# Altium schematic sheet Boost-Shield.SchDoc
size A; SheetNumber: 1; SheetTotal: 1
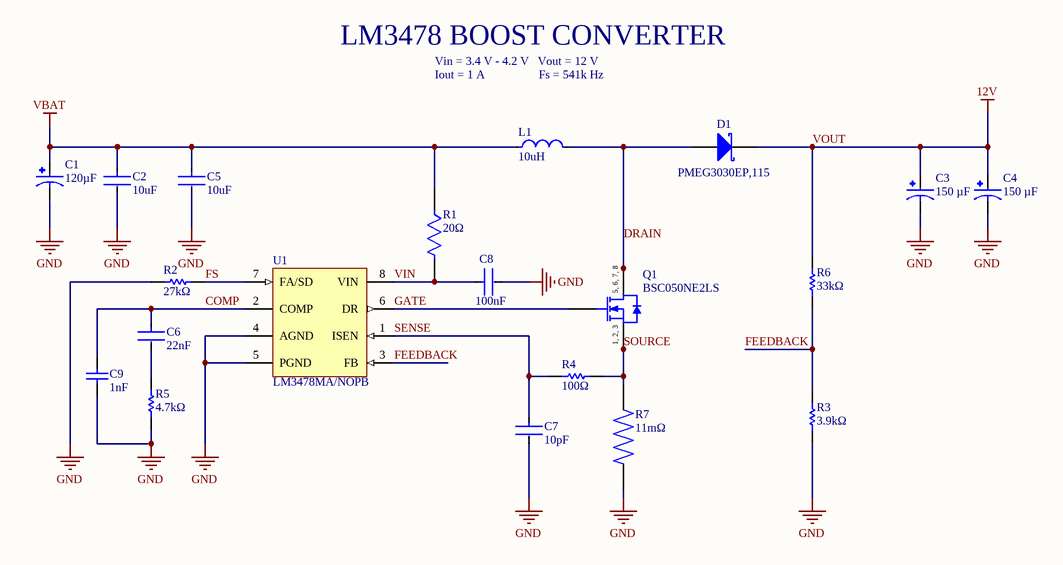
[diagram p0: Boost-Shield.SchDoc]

## Parts
C1  120µF  [CAP_EEFCX0J121R]
C2  10uF  [FP-C0805C-DG-MFG]
C3  150 µF  [CAP_16TDC150MYF]
C4  150 µF  [CAP_16TDC150MYF]
C5  10uF  [FP-C0805C-DG-MFG]
C6  22nF  [FP-CGA4J-MFG]
C7  10pF  [FP-C0805C-DN-MFG]
C8  100nF  [FP-CC0805-0_85-MFG]
C9  1nF  [CAPC2013X140X50NL20T25]
D1  PMEG3030EP,115  [NXP-SOD128_V]
L1  10uH  [FP-IHLP-3232DZ-FP_2_413x5-MFG]
Q1  BSC050NE2LS  [INF-PG-TDSON-8-1_V]
R1  20Ω  [FP-CRCW0805-e3-IPC_C]
R2  27kΩ  [RESC2013X50X30ML20T20]
R3  3.9kΩ  [RESC2013X50X30LL20T20]
R4  100Ω  [RESC2013X50X30ML20T20]
R5  4.7kΩ  [RESC2013X70X40NL20T20]
R6  33kΩ  [RESC2013X50X30LL20T20]
R7  11mΩ  [RESC3115X65N]
U1  LM3478MA/NOPB  [D0008A_L]

## Nets
GND: C1.2 C2.2 C3.2 C4.2 C5.2 C7.2 C8.2 C9.1 R2.1 R3.1 R5.1 R7.1 U1.4(AGND) U1.5(PGND)
VBAT: C1.1 C2.1 C5.1 L1.1 R1.1
VOUT: C3.1 C4.1 D1.2(K) R6.2  [also labelled 12V]
COMP: C6.1 C9.2 U1.2(COMP)
DRAIN: D1.1(A) L1.2 Q1.5(DRAIN) Q1.6(DRAIN) Q1.7(DRAIN) Q1.8(DRAIN)
FEEDBACK: R3.2 R6.1 U1.3(FB)
FS: R2.2 U1.7(FA/SD)
GATE: Q1.4(GATE) U1.6(DR)
SENSE: C7.1 R4.1 U1.1(ISEN)
SOURCE: Q1.1(SOURCE) Q1.2(SOURCE) Q1.3(SOURCE) R4.2 R7.2
VIN: C8.1 R1.2 U1.8(VIN)
NetC6_2: C6.2 R5.2

## Notes on the sheet
- LM3478 BOOST CONVERTER
- Vin = 3.4 V - 4.2 V   Vout = 12 V
  Iout = 1 A                  Fs = 541k Hz
- (in symbol CMP-1090-00044-1) 5, 6, 7, 8; 1, 2, 3

## Library data of the parts
C1 = EEFCX0J121R: 120µF 6.3V Aluminum - Polymer Capacitors 2917 (7343 Metric) 15mOhm 2000 Hrs @ 105°C  EEFCX0J121R
C2 C5 = CMP-2007-03243-2: CAP CER 10UF 10V X5R 0805; Manufacturer Part Number: C0805C106K8PACTU; Manufacturer: Kemet; 3DS Part Number: 220-00001; Tolerance: 10%; Temperature Coefficient: 15%; Material: Ceramic; Device Class L2: Capacitors; Device Class L1: Passive Components; ComponentLink2URL: https://content.kemet.com/datasheets/KEM_C1006_X5R_SMD.pdf; Height: 1.4mm; Lead Free: Yes; Digikey Description: CAP CER 10UF 10V X5R 0805; Octopart: https://octopart.com/c0805c106k8pactu-kemet-98697; Capacitance: 10uF; Value: 10uF; Temperature Range Low: -55°C; Temperature: -55°C to +85°C; Automotive: No; Mouser Description: CAP CER 10UF 10V X5R 0805; Ipc Land Pattern Name: CAPC200125X125; Temperature Range High: +85°C; Voltage: 10V; RoHS: TRUE; Device Class L3: Ceramic Capacitors; ComponentLink2Description: Datasheet; Voltage Rating: 10V; Package: C0805C-DG; Temperature Characteristic: X5R; Category: Cap
C3 C4 = 16TDC150MYF: 150 µF Molded Tantalum Polymer Capacitor 16 V 2917 (7343 Metric) 50mOhm @ 100kHz
C6 = CMP-08246-000753-1: Cap Ceramic 22nF 50V C0G 5% Pad SMD 0805 +125°C Automotive T/R CGJ4J2C0G1H223J125AA; Capacitance: 22nF; Case/Package: 0805; Lead Free: Lead Free; Ratings: AEC-Q200; Case Code (Imperial): 0805; Height: 1.25mm; Length: 2mm; Weight: 0.000194oz; Tolerance: 5%; Dielectric: C0G; Voltage Rating: 50V; Max Operating Temperature: 125°C; Mount: Surface Mount; Case Code (Metric): 2012; REACH SVHC: No SVHC; Depth: 1.25mm; Width: 0.049inch; Package Quantity: 1; Voltage Rating (DC): 50V; Termination: SMD/SMT; Min Operating Temperature: -55°C; Thickness: 0.057inch; Packaging: Tape and Reel; Composition: Ceramic
C7 = CMP-1036-00838-4: CAP CER 10PF 16V 20% NP0 0805; Manufacturer Part Number: C0805C100M4GACTU; Manufacturer: KEMET; Material: Ceramic; Tolerance: 0.2; Temperature Characteristic: C0G; Temperature Coefficient: 30ppm/°C; Height: 0.88mm; Mouser Description: Multilayer Ceramic Capacitors MLCC - SMD/SMT 16volts 10pF C0G 20%; Device Class L2: Capacitors; Temperature Range Low: -55°C; ComponentLink2URL: https://content.kemet.com/datasheets/KEM_C1003_C0G_SMD.pdf; Category: Cap; Octopart: https://octopart.com/c0805c100m4gactu-kemet-16430157; Device Class L1: Passive Components; Capacitance: 10 pF; Temperature: -55°C to +125°C; RoHS: TRUE; Package: C0805C-DN; Device Class L3: Ceramic Capacitors; Automotive: No; Value: 10 pF; Voltage Rating: 16 V; Digikey Description: CAP CER 10PF 16V 20% NP0 0805; Temperature Range High: +125°C; Ipc Land Pattern Name: CAPC200125X78; Lead Free: Yes; ComponentLink2Description: Datasheet
C8 = CMP-1036-04402-6: CAP CER 0.1UF 16V X7R 0805; Manufacturer Part Number: CC0805KRX7R7BB104; Manufacturer: Yageo; Material: Ceramic; Tolerance: 0.1; Temperature: -30°C to +85°C; Lead Free: Yes; Footprint Url: http://www.yageo.com/exep/pages/download/literatures/UPY-C_GEN_24.pdf; Voltage Rating: 16 V; Package: CC0805-0.85; RoHS: TRUE; Digikey Description: CAP CER 0.1UF 16V X7R 0805; Category: Cap; Octopart: https://octopart.com/cc0805krx7r7bb104-yageo-39467769; Capacitance: 100 nF; Device Class L3: Ceramic Capacitors; ComponentLink2URL: http://www.yageo.com/documents/recent/UPY-GPHC_Y5V_6.3V-to-50V_8.pdf; Value: 100 nF; Temperature Range Low: -30°C; Mouser Description: Multilayer Ceramic Capacitors MLCC - SMD/SMT 100nF 16V X7R 10%; Automotive: No; Device Class L2: Capacitors; Height: 0.95mm; ComponentLink2Description: Datasheet; Temperature Characteristic: X7R; Ipc Land Pattern Name: CAPC200125X85; Device Class L1: Passive Components; Temperature Range High: +85°C
C9 = CMP-2007-04527-1: 08051A102JAT2A; Manufacturer: AVX Interconnect / Elco; Part Number: 08051A102JAT2A
D1 = CMP-2000-06906-1: Schottky Barrier Rectifier, 3 A, 30 V, -55 to 150 degC, 2-Pin SOD128, RoHS, Tape and Reel; Manufacturer: NXP Semiconductors; Other Names: 568-6761-6; Package Version: 02/2016; Capacitance @ Vr, F: 470pF@1V,1MHz; PCN Packaging: LighterReels02/Jan/2014; Speed: FastRecovery=200mA(Io); Current - Average Rectified (Io): 3A; Current - Reverse Leakage @ Vr: 5mA@30V; Voltage - DC Reverse (Vr) (Max): 30V; Online Catalog: SchottkyDiode; Voltage - Forward (Vf) (Max) @ If: 360mV@3A; Datasheet Version: Rev. 01, 12/2009; Mounting Type: SurfaceMount; Packaging: Digi-Reel®; Package URL: http://www.nxp.com/documents/outline_drawing/SOD128.pdf; Series: -; Package / Case: SOD-128; Supplier Device Package: SOD-128; Package Reference: SOD128; Manufacturer URL: http://www.nxp.com/; Operating Temperature - Junction: 150°C(Max); Family: Diodes,Rectifiers-Single; Standard Package: 1; Reverse Recovery Time (trr): -; Diode Type: Schottky; Mounting Technology: SurfaceMount; Category: DiscreteSemiconductorProducts; Package Description: 2-Pin Plastic Surface-Mounted Package, Body 2.5 x 3.8 mm; Datasheet URL: http://www.nxp.com/documents/data_sheet/PMEG3030EP.pdf
L1 = CMP-02424-000288-1: FIXED IND 10UH 5.2A 59.9 MOHM; DC Resistance (DCR): 59.9mR; Inductance Tolerance: 20%; Core Material: Metal; Test Frequency: 100kHz; Self Resonant Frequency: 15MHz; Shielding: Shielded; Saturation Current: 9A; Current Rating: 5.2A; Number of Pins: 2; Length: 8.64mm; Width: 0.322inch; Mount: Surface Mount; Termination: SMD/SMT; Radiation Hardening: No; Height: 4mm; Case/Package: 3232; Min Operating Temperature: -55°C; Military Standard: Not; Depth: 8.26mm; Lead Free: Lead Free; Max DC Current: 5.2A; Height - Seated (Max): 0.157inch; Packaging: Tape and Reel; Tolerance: 20%; Max Operating Temperature: 125°C; RMS Current (Irms): 5.2A; Package Quantity: 500; Inductance: 10uH
Q1 = CMP-1090-00044-1: N-Channel OptiMOS Power-MOSFET, 25 V VDS, 58 A ID, -55 to 150 degC, PG-TDSON-8-1, Reel, Green; Manufacturer: Infineon; RthJA (max): 50Â K/W; Polarity: N; RthJC (max): 4.5Â K/W; RDS (on) (max): 5Â mOhm; Ptot (max): 28Â W; RDS (on) (max) (@4.5V): 7.1Â mOhm; ID (max): 58Â A; VGS(th) (min): 1.2Â V; VDS (max): 25Â V; QG: 5Â nC; Green: TRUE; IDpuls (max): 232Â A; VGS(th) (max): 2Â V; ComponentLink3Description: Package Specification; ComponentLink2URL: http://www.infineon.com/dgdl/BSC050NE2LS_Rev+2.1_.pdf?folderId=db3a304326dfb1300126fb3bec803f1a&fileId=db3a304326dfb1300126fb5ce0cb3f2d; ComponentLink1Description: Manufacturer URL; Rth: 4.5Â K/W; ComponentLink3URL: http://www.infineon.com/cms/packages/SMD_-_Surface_Mounted_Devices/P-PG-TDSON/P-PG-TDSON-08-01x_2x_3.html?__locale=en; PackageReference: PG-TDSON-8-1; PartNumber: BSC050NE2LS; PackageDescription: 8-Pin Plastic (Green) Thin Dual Small Outline Non-Leaded Package, 5.15 x 5.9 mm Body, 1.27 mm Pitch; DatasheetVersion: Rev. 2.1; Packing: Reel; Mounting Technology: Surface Mount; ComponentLink1URL: http://www.infineon.com/; ComponentLink2Description: Datasheet; Halogen-free: TRUE
R1 = CMP-2001-03669-2: RES Thick Film, 20Ω, 1%, 0.125W, 100ppm/°C, 0805; Voltage Rating (DC): 150V; Power Rating: 125mW; Resistance: 20R; Case Code (Metric): 2012; Height: 0.02inch; Width: 0.049inch; Tolerance: 1%; Military Standard: Not; Case Code (Imperial): 0805; Case/Package: 0805; Min Operating Temperature: -55°C; Composition: Thick Film; Radiation Hardening: No; Depth: 1.25mm; Length: 2mm; Features: Automotive AEC-Q200; Max Power Dissipation: 125mW; Weight: 0.000194oz; Voltage Rating: 150V; Packaging: Tape and Reel; Temperature Coefficient: 100ppm/°C; Contact Plating: Tin; Package Quantity: 10; Max Operating Temperature: 155°C; Termination: Solder; Number of Terminations: 2; Lead Free: Lead Free
R2 = CMP-2001-03741-1: CRCW080527K0FKEA; Manufacturer: Vishay Dale; Part Number: CRCW080527K0FKEA
R3 = CMP-1013-00576-2: CRCW08053K90FKEA; Manufacturer: Vishay Dale; Part Number: CRCW08053K90FKEA
R4 = CMP-2001-04903-1: CRCW0805100RJNEA; Manufacturer: Vishay Dale; Part Number: CRCW0805100RJNEA
R5 = CMP-2001-00550-5: Chip Resistor, 4.7 KOhm, +/- 1%, 0.125 W, -55 to 155 degC, 0805 (2012 Metric), RoHS, Tape and Reel; Manufacturer: Panasonic; Voltage Rating: 150 V; Min Operating Temperature: -55 degC; PackageReference: 0805; Mounting Technology: Surface Mount; Height: 0.6 mm; PackageDescription: 2-Pin Surface Mount Device, Body 2 x 1.25 mm; RoHSCompliant: true; Length: 2 mm; REACH SVHC: Yes; Packaging: Tape and Reel; Pins: 2; Mount: Surface Mount; ComponentLink2Description: Datasheet; ComponentLink1URL: http://www.panasonic.com/; ComponentLink1Description: Manufacturer URL; DatasheetVersion: 04/2015; Package Quantity: 5000; ComponentLink2URL: http://industrial.panasonic.com/cdbs/www-data/pdf/RDA0000/AOA0000C86.pdf; Max Operating Temperature: 155 degC
R6 = CMP-2001-03828-1: CRCW080533K0JNEA; Manufacturer: Vishay Dale; Part Number: CRCW080533K0JNEA
R7 = RLP73V2BR011FTDF: 11 mOhms ±1% 0.5W, 1/2W Chip Resistor 1206 (3216 Metric) Current Sense Thick Film
U1 = CMP-0063-01437-3: High Efficiency Low-Side N-Channel Controller for Switching Regulator, 8-pin Narrow SOIC, 1000 Reel; Manufacturer: Texas Instruments; CompType: MiscPower; PackageTopMarking: NSZXTT*L3478*MA; High-Reliability: Y; PowerWise: N; ComponentLink1URL: http://www.ti.com/general/docs/lit/getliterature.tsp?genericPartNumber=LM3478&fileType=pdf; PinCount: 8; PartNumber: LM3478MA/NOPB; PackageDescription: SOIC Narrow, 4.9 x 3.9 x 1.45mm, 8 Lead, 1.27mm Pitch; PackageReference: D0008A; Code_IPC: SOIC127P600-8; RoHS: Y; Code_JEDEC: MS-012-AA; ComponentLink1Description: Datasheet URL